# EAGLE design M617C (EAGLE 6.6.0)
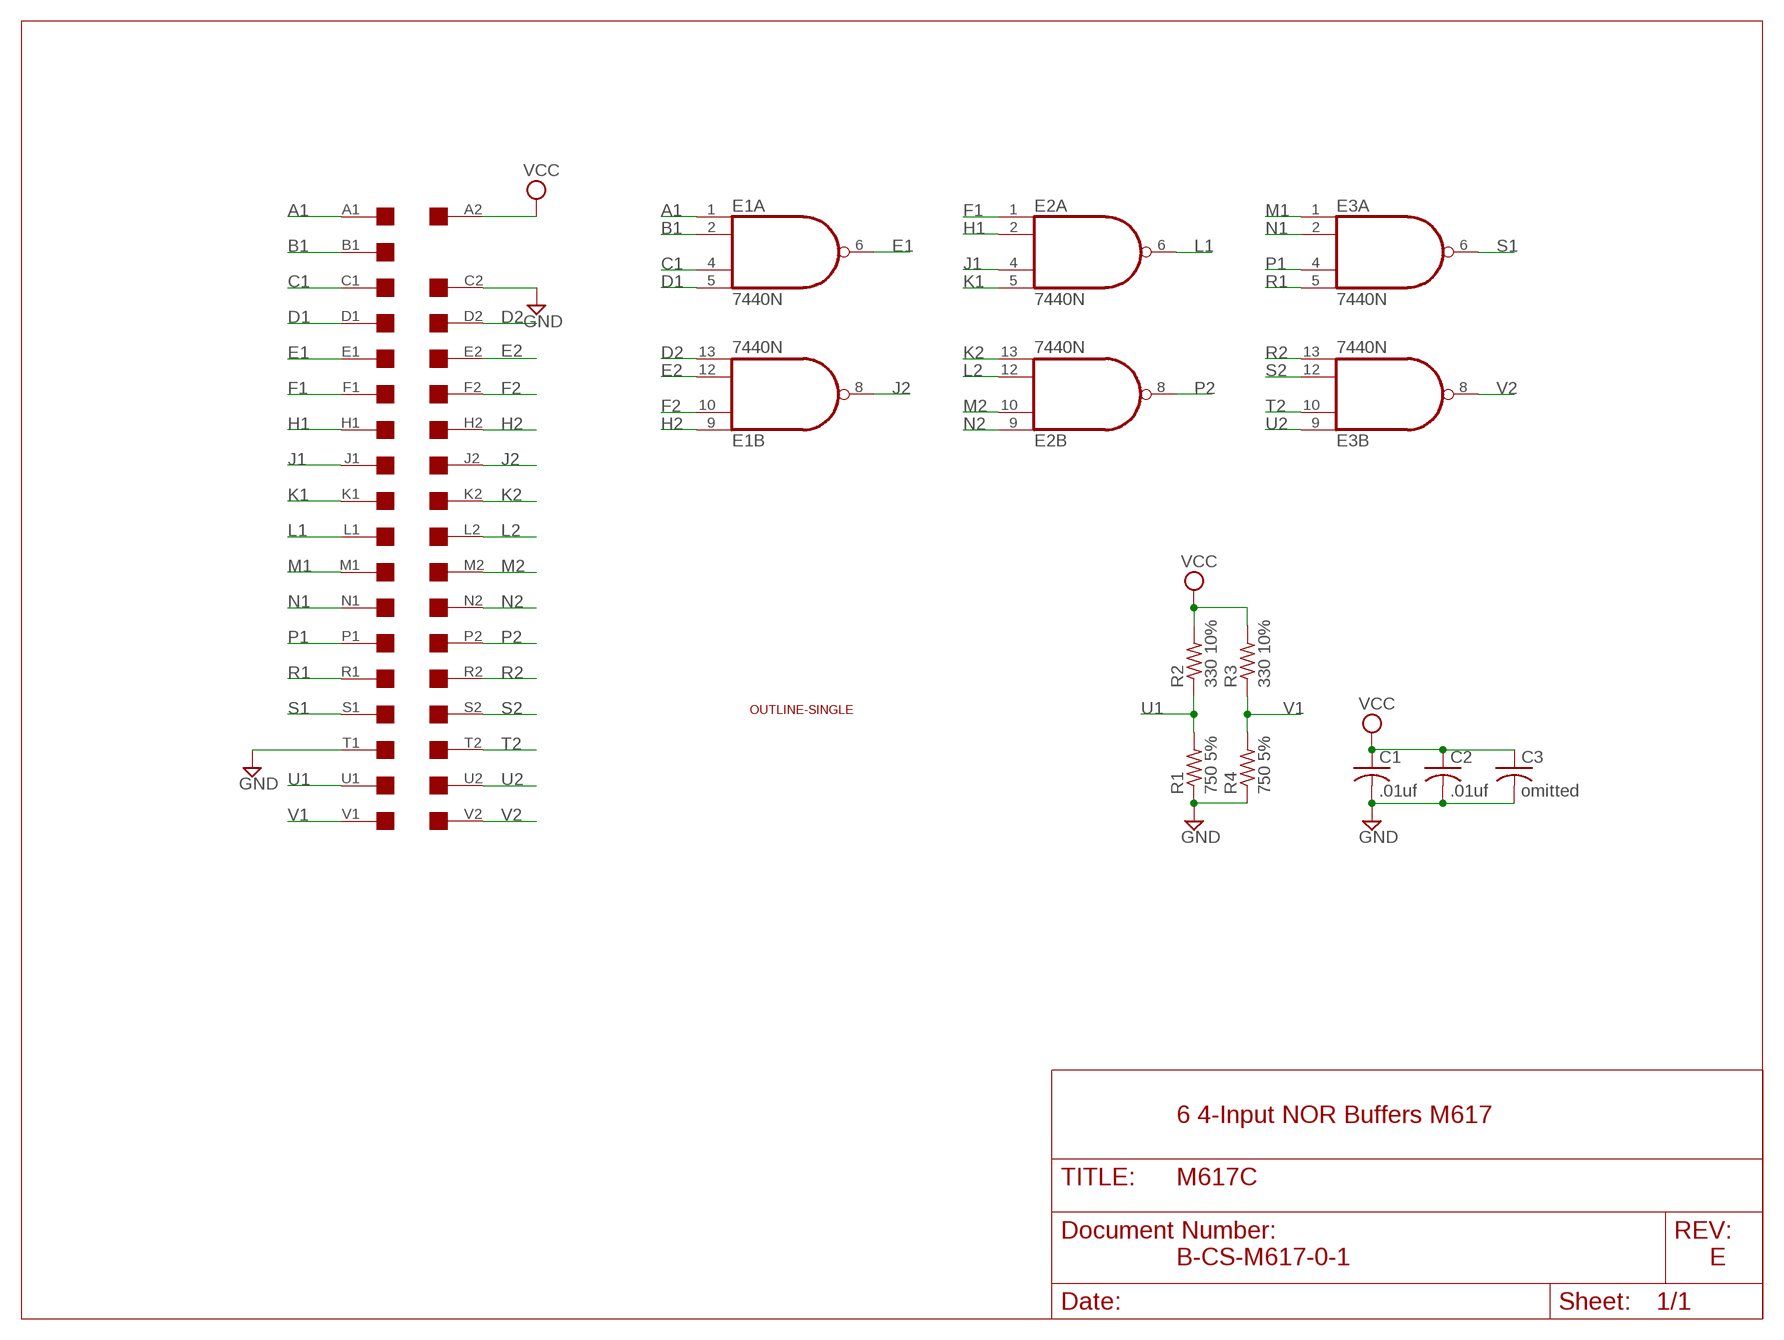
[diagram p0: schematic, sheet 1]

## Parts
C1  .01uf  C-US050-025X075  [C050-025X075]
C2  .01uf  C-US050-025X075  [C050-025X075]
C3  omitted  C-US050-025X075  [C050-025X075]
E1  7440N  74S20N  [DIL14]
E2  7440N  74S20N  [DIL14]
E3  7440N  74S20N  [DIL14]
R1  750 5%  R-US_0207/10  [0207/10]
R2  330 10%  R-US_0207/10  [0207/10]
R3  330 10%  R-US_0207/10  [0207/10]
R4  750 5%  R-US_0207/10  [0207/10]
U$1  SINGLE  [EDGE-CON2]
U$4  OUTLINE-SINGLE  [SINGLE]

## Nets
A1: E1.1(A:I0) U$1.A1
B1: E1.2(A:I1) U$1.B1
C1: E1.4(A:I2) U$1.C1
D1: E1.5(A:I3) U$1.D1
D2: E1.13(B:I3) U$1.D2
E1: E1.6(A:O) U$1.E1
E2: E1.12(B:I2) U$1.E2
F1: E2.1(A:I0) U$1.F1
F2: E1.10(B:I1) U$1.F2
GND: C1.2 C2.2 C3.2 R1.1 R4.1 U$1.C2 U$1.T1
H1: E2.2(A:I1) U$1.H1
H2: E1.9(B:I0) U$1.H2
J1: E2.4(A:I2) U$1.J1
J2: E1.8(B:O) U$1.J2
K1: E2.5(A:I3) U$1.K1
K2: E2.13(B:I3) U$1.K2
L1: E2.6(A:O) U$1.L1
L2: E2.12(B:I2) U$1.L2
M1: E3.1(A:I0) U$1.M1
M2: E2.10(B:I1) U$1.M2
N1: E3.2(A:I1) U$1.N1
N2: E2.9(B:I0) U$1.N2
P1: E3.4(A:I2) U$1.P1
P2: E2.8(B:O) U$1.P2
R1: E3.5(A:I3) U$1.R1
R2: E3.13(B:I3) U$1.R2
S1: E3.6(A:O) U$1.S1
S2: E3.12(B:I2) U$1.S2
T2: E3.10(B:I1) U$1.T2
U1: R1.2 R2.1 U$1.U1
U2: E3.9(B:I0) U$1.U2
V1: R3.1 R4.2 U$1.V1
V2: E3.8(B:O) U$1.V2
VCC: C1.1 C2.1 C3.1 R2.2 R3.2 U$1.A2
Unconnected: U$1.B2

## Notes on the sheet
- 6 4-Input NOR Buffers M617
- B-CS-M617-0-1 | E

## Power pins joined to a net without a drawn wire
GND: E1.7(P:GND) E2.7(P:GND) E3.7(P:GND)
VCC: E1.14(P:VCC) E2.14(P:VCC) E3.14(P:VCC)

## Library data of the parts
C1-C3 = rcl:C-US: CAPACITOR, American symbol
E1-E3 = 74xx-us:74*20: Dual 4-input NAND gate
R1-R4 = rcl:R-US_: RESISTOR, American symbol
U$1 = dec-con:SINGLE: Single-Height DEC board
U$4 = dec-con:OUTLINE-*: Board outlines for DEC boards.

## Board
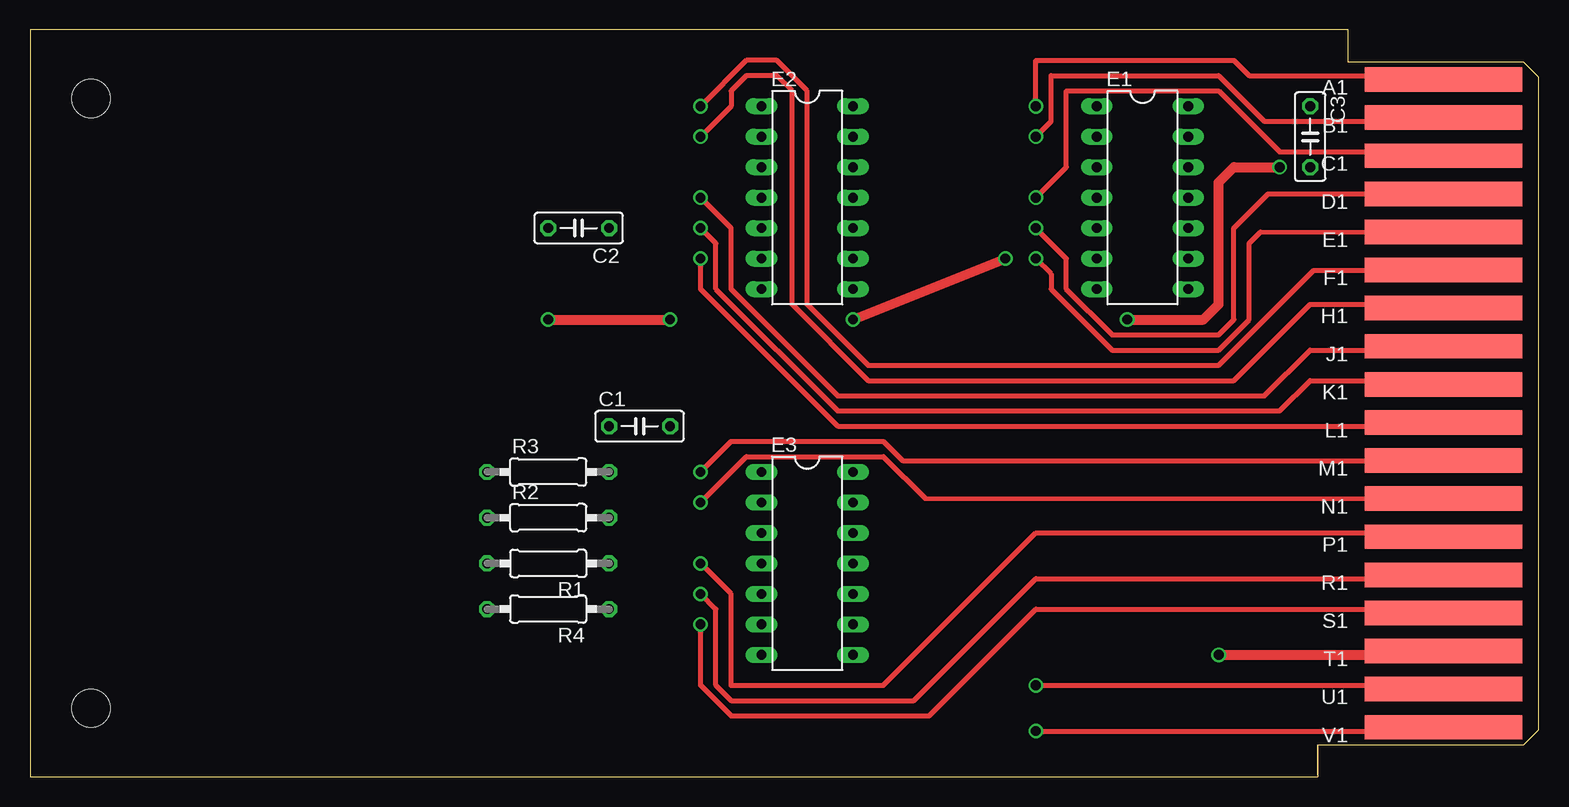
[diagram p1: board, top side]
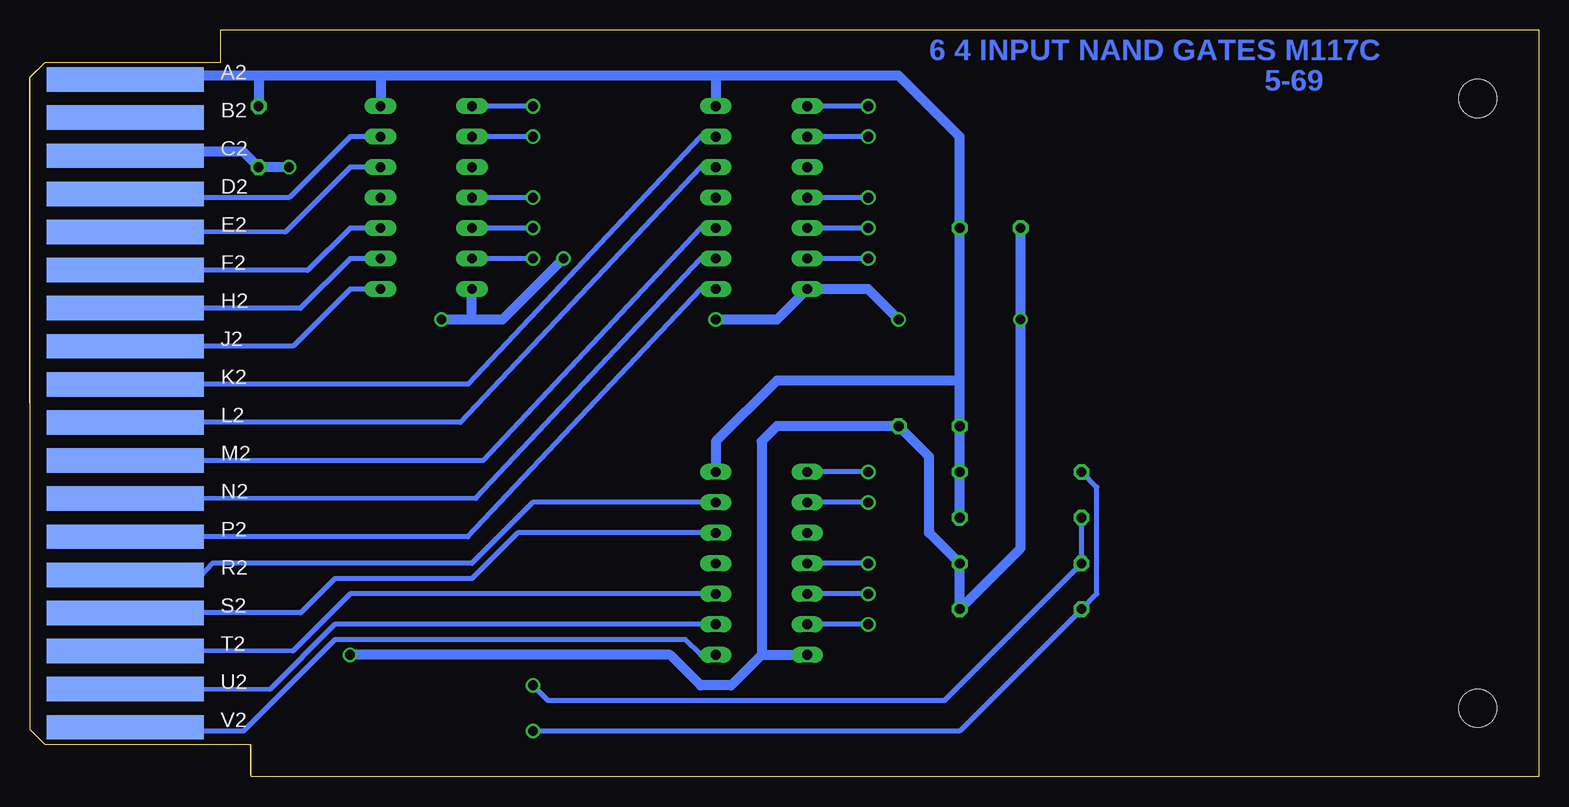
[diagram p2: board, bottom side, seen from below]

Size 125.73 x 62.23 mm. Coordinates in mm from the lower left corner, seen from the top.
Copper layers (1+16): Top 0.035mm / dielectric 1.5mm / Bottom 0.035mm
Design rules "16mils": minimum track width 16mil, minimum drill 32mil, track to track 15mil, track to pad 10mil, pad to pad 10mil, via to via 10mil, smd to smd 10mil, copper to edge 13mil, drill to drill 10mil, minimum pad ring 10mil, minimum via ring 8mil, stop-mask expansion 0mil, vias tented up to drill 0mil, thermal gap 10mil

### Footprints (pad centres in the part's own frame; a part is rotated, then mirrored left to right if it is on the bottom)
C050-025X075 = drill 0.813 octagon: 1 -2.54,0; 2 2.54,0
DIL14 = drill 0.813 long: 1 -7.62,-3.81; 2 -5.08,-3.81; 3 -2.54,-3.81; 4 0,-3.81; 5 2.54,-3.81; 6 5.08,-3.81; 7 7.62,-3.81; 8 7.62,3.81; 9 5.08,3.81; 10 2.54,3.81; 11 0,3.81; 12 -2.54,3.81; 13 -5.08,3.81; 14 -7.62,3.81
0207/10 = drill 0.813 octagon: 1 -5.08,0; 2 5.08,0
EDGE-CON2 = smd 13.106 x 2.032: A1 7.938,4.128; B1 7.938,7.303; C1 7.938,10.477; D1 7.938,13.652; E1 7.938,16.828; F1 7.938,20.003; H1 7.938,23.177; J1 7.938,26.352; K1 7.938,29.527; L1 7.938,32.703; M1 7.938,35.877; N1 7.938,39.053; P1 7.938,42.227; R1 7.938,45.403; S1 7.938,48.578; T1 7.938,51.752; U1 7.938,54.928; V1 7.938,58.102 | smd 13.106 x 2.032 bottom: A2 7.938,4.128; B2 7.938,7.303; C2 7.938,10.477; D2 7.938,13.652; E2 7.938,16.828; F2 7.938,20.003; H2 7.938,23.177; J2 7.938,26.352; K2 7.938,29.527; L2 7.938,32.703; M2 7.938,35.877; N2 7.938,39.053; P2 7.938,42.227; R2 7.938,45.403; S2 7.938,48.578; T2 7.938,51.752; U2 7.938,54.928; V2 7.938,58.102
SINGLE = hole 3.175: 120.65,56.515; 120.65,5.715

### Placement (x,y rotation side)
C1  50.8,29.21 0 top
C2  45.72,45.72 180 top
C3  106.68,53.34 270 top
E1  92.71,48.26 270 top
E2  64.77,48.26 270 top
E3  64.77,17.78 270 top
R1  43.18,17.78 180 top
R2  43.18,21.59 0 top
R3  43.18,25.4 0 top
R4  43.18,13.97 180 top
U$1  125.73,62.23 180 top
U$4  125.73,62.23 180 top

### Tracks (layer width: path | path; a pad name or v marks a point on that pad's centre or on a via)
A1  (via drill 0.81)
  Top 0.406: U$1.A1 112.16,58.02 111.76,58.42 101.6,58.42 100.33,59.69 83.82,59.69 v83.82,55.88
  Bottom 0.406: v83.82,55.88 E1.1
B1  (via drill 0.81)
  Top 0.406: U$1.B1 112.05,54.9 111.76,54.61 102.87,54.61 99.06,58.42 85.09,58.42 85.09,54.61 v83.82,53.34
  Bottom 0.406: v83.82,53.34 E1.2
C1  (via drill 0.81)
  Top 0.406: U$1.C1 112.09,51.74 111.76,52.07 104.14,52.07 99.06,57.15 86.36,57.15 86.36,50.8 v83.82,48.26
  Bottom 0.406: v83.82,48.26 E1.4
D1  (via drill 0.81)
  Top 0.406: U$1.D1 103.17,48.56 100.33,45.72 100.33,38.1 99.06,36.83 90.17,36.83 86.36,40.64 86.36,43.18 v83.82,45.72
  Bottom 0.406: v83.82,45.72 E1.5
D2
  Bottom 0.406: U$1.D2 112.06,48.56 111.76,48.26 104.14,48.26 99.06,53.34 E1.13
E1  (via drill 0.81)
  Top 0.406: U$1.E1 102.54,45.39 101.6,44.45 101.6,38.1 99.06,35.56 90.17,35.56 85.09,40.64 85.09,41.91 v83.82,43.18
  Bottom 0.406: v83.82,43.18 E1.6
E2
  Bottom 0.406: U$1.E2 104.47,45.39 99.06,50.8 E1.12
F1  (via drill 0.81)
  Top 0.406: U$1.F1 106.96,42.19 99.06,34.29 69.85,34.29 64.77,39.37 64.77,57.15 62.23,59.69 59.69,59.69 v55.88,55.88
  Bottom 0.406: v55.88,55.88 E2.1
F2
  Bottom 0.406: U$1.F2 102.59,42.19 99.06,45.72 E1.10
GND  (via drill 0.81)
  Top 0.406: 117.76,10.16 U$1.T1
  Top 0.813: v104.14,50.8 100.33,50.8 99.06,49.53 99.06,39.37 97.79,38.1 v91.44,38.1 | v68.58,38.1 v81.28,43.18 | v43.18,38.1 v53.34,38.1 | v99.06,10.16 117.76,10.16
  Bottom 0.813: 64.77,10.16 64.77,27.94 63.5,29.21 C1.2 50.8,26.67 50.8,20.32 R1.1 R4.1 43.18,19.05 v43.18,38.1 C2.2 | 64.77,10.16 E3.7 | U$1.C2 113.36,51.74 113.03,52.07 107.95,52.07 C3.2 v104.14,50.8 | 88.9,38.1 86.36,38.1 v81.28,43.18 | 88.9,38.1 v91.44,38.1 | v68.58,38.1 63.5,38.1 E2.7 55.88,40.64 v53.34,38.1 | 88.9,38.1 E1.7 | 64.77,10.16 67.31,7.62 69.85,7.62 72.39,10.16 v99.06,10.16
H1  (via drill 0.81)
  Top 0.406: U$1.H1 117.76,39.37 106.68,39.37 100.33,33.02 69.85,33.02 63.5,39.37 63.5,57.15 62.23,58.42 59.69,58.42 58.42,57.15 58.42,55.88 v55.88,53.34
  Bottom 0.406: v55.88,53.34 E2.2
H2
  Bottom 0.406: U$1.H2 103.2,39.04 99.06,43.18 E1.9
J1  (via drill 0.81)
  Top 0.406: U$1.J1 117.76,35.56 106.68,35.56 102.87,31.75 67.31,31.75 58.42,40.64 58.42,45.72 v55.88,48.26
  Bottom 0.406: v55.88,48.26 E2.4
J2
  Bottom 0.406: U$1.J2 103.81,35.89 99.06,40.64 E1.8
K1  (via drill 0.81)
  Top 0.406: U$1.K1 117.78,33.02 106.68,33.02 104.14,30.48 67.31,30.48 57.15,40.64 57.15,44.45 v55.88,45.72
  Bottom 0.406: v55.88,45.72 E2.5
K2
  Bottom 0.406: U$1.K2 89.2,32.72 69.85,53.34 E2.13
L1  (via drill 0.81)
  Top 0.406: U$1.L1 117.76,29.21 67.31,29.21 55.88,40.64 v55.88,43.18
  Bottom 0.406: v55.88,43.18 E2.6
L2
  Bottom 0.406: U$1.L2 89.84,29.54 69.85,50.8 E2.12
M1  (via drill 0.81)
  Top 0.406: U$1.M1 72.72,26.34 71.12,27.94 58.42,27.94 v55.88,25.4
  Bottom 0.406: v55.88,25.4 E3.1
M2
  Bottom 0.406: U$1.M2 87.96,26.34 69.85,45.72 E2.10
N1  (via drill 0.81)
  Top 0.406: U$1.N1 74.6,23.19 71.12,26.67 59.69,26.67 v55.88,22.86
  Bottom 0.406: v55.88,22.86 E3.2
N2
  Bottom 0.406: U$1.N2 88.57,23.19 69.85,43.18 E2.9
P1  (via drill 0.81)
  Top 0.406: U$1.P1 117.76,20.32 83.82,20.32 71.12,7.62 58.42,7.62 58.42,15.24 v55.88,17.78
  Bottom 0.406: v55.88,17.78 E3.4
P2
  Bottom 0.406: U$1.P2 89.23,19.99 69.85,40.64 E2.8
R1  (via drill 0.81)
  Top 0.406: U$1.R1 117.76,16.51 83.82,16.51 73.66,6.35 58.42,6.35 57.15,7.62 57.15,13.97 v55.88,15.24
  Bottom 0.406: v55.88,15.24 E3.5
R2
  Bottom 0.406: U$1.R2 111.76,16.51 111.56,16.71 110.54,17.78 88.9,17.78 83.82,22.86 E3.13
S1  (via drill 0.81)
  Top 0.406: U$1.S1 117.78,13.97 83.82,13.97 74.93,5.08 58.42,5.08 55.88,7.62 v55.88,12.7
  Bottom 0.406: v55.88,12.7 E3.6
S2
  Bottom 0.406: U$1.S2 103.17,13.66 100.33,16.51 88.9,16.51 85.09,20.32 E3.12
T2
  Bottom 0.406: U$1.T2 103.81,10.49 99.06,15.24 E3.10
U1  (via drill 0.81)
  Top 0.406: U$1.U1 117.73,7.62 v83.82,7.62
  Bottom 0.406: R2.1 R1.2 49.53,6.35 82.55,6.35 v83.82,7.62
U2
  Bottom 0.406: U$1.U2 105.77,7.26 100.33,12.7 E3.9
V1  (via drill 0.81)
  Top 0.406: U$1.V1 117.21,3.81 v83.82,3.81
  Bottom 0.406: R3.1 36.83,24.13 36.83,15.24 R4.2 48.26,3.81 v83.82,3.81
V2
  Bottom 0.406: U$1.V2 113.91,4.2 113.03,3.81 107.95,3.81 100.33,11.43 71.12,11.43 69.85,10.16 E3.8
VCC
  Bottom 0.813: U$1.A2 113.03,58.02 111.76,58.42 106.68,58.42 | 106.68,58.42 C3.1 | 96.52,58.42 E1.14 | 96.52,58.42 106.68,58.42 | 68.58,58.42 E2.14 | 68.58,58.42 96.52,58.42 | 68.58,58.42 53.34,58.42 48.26,53.34 C2.1 48.26,33.02 | 48.26,33.02 C1.1 R3.2 R2.2 | E3.14 68.58,27.94 63.5,33.02 48.26,33.02

### Text on the board
Bottom: 6 4 INPUT NAND GATES M117C | 5-69
tDocu: Use M117 Etch